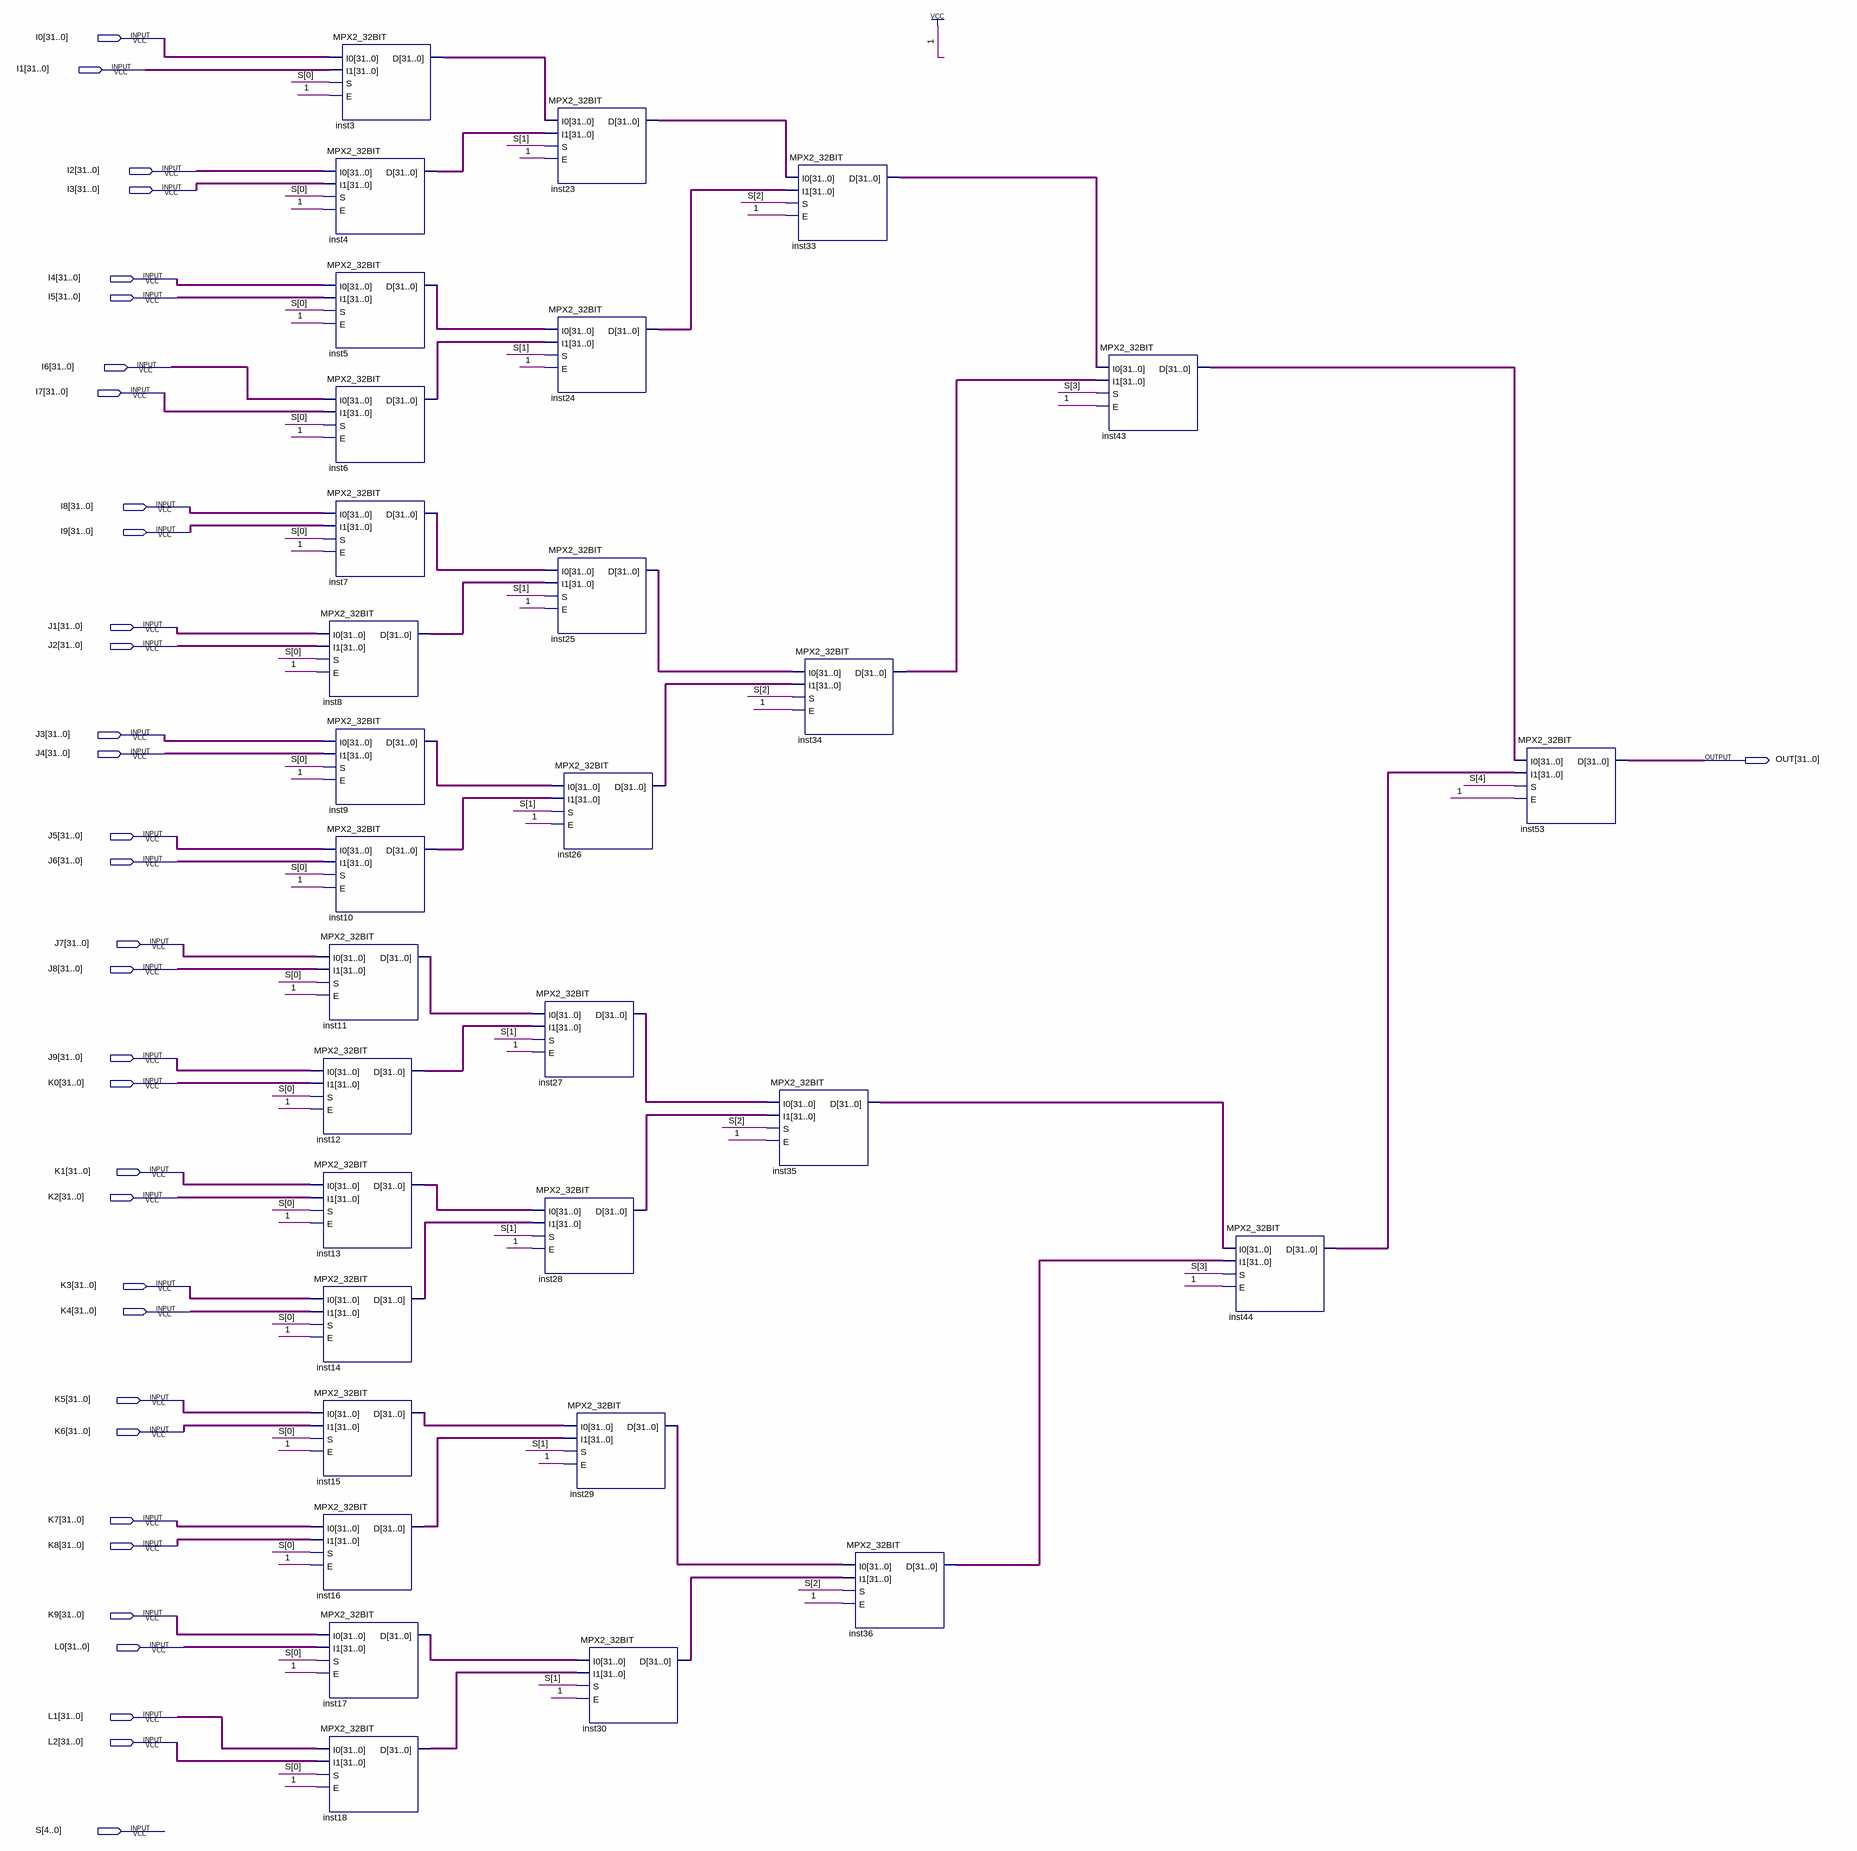
[diagram p0: schematic sheet]
// Quartus schematic MUX32_1.bdf as structural Verilog: 31 symbols, 34 pins
module MUX32_1 (
  input  [31:0] I0,
  input  [31:0] I1,
  input  [31:0] I2,
  input  [31:0] I3,
  input  [31:0] I4,
  input  [31:0] I5,
  input  [31:0] I6,
  input  [31:0] I7,
  input  [31:0] I8,
  input  [31:0] I9,
  input  [31:0] J1,
  input  [31:0] J2,
  input  [31:0] J3,
  input  [31:0] J4,
  input  [31:0] J5,
  input  [31:0] J6,
  input  [31:0] J7,
  input  [31:0] J8,
  input  [31:0] J9,
  input  [31:0] K0,
  input  [31:0] K1,
  input  [31:0] K2,
  input  [31:0] K3,
  input  [31:0] K4,
  input  [31:0] K5,
  input  [31:0] K6,
  input  [31:0] K7,
  input  [31:0] K8,
  input  [31:0] K9,
  input  [31:0] L0,
  input  [31:0] L1,
  input  [31:0] L2,
  input  [4:0] S,
  output [31:0] OUT
);

  wire [31:0] inst3_d, inst4_d, inst5_d, inst6_d, inst7_d, inst8_d, inst9_d, inst10_d, inst11_d, inst12_d,
       inst13_d, inst14_d, inst15_d, inst16_d, inst17_d, inst18_d, inst23_d, inst24_d, inst25_d, inst26_d,
       inst27_d, inst28_d, inst29_d, inst30_d, inst33_d, inst34_d, inst35_d, inst36_d, inst43_d, inst44_d;

  MPX2_32BIT inst4 (.I0(I2), .I1(I3), .S(S[0]), .E(1'b1), .D(inst4_d));
  MPX2_32BIT inst5 (.I0(I4), .I1(I5), .S(S[0]), .E(1'b1), .D(inst5_d));
  MPX2_32BIT inst6 (.I0(I6), .I1(I7), .S(S[0]), .E(1'b1), .D(inst6_d));
  MPX2_32BIT inst7 (.I0(I8), .I1(I9), .S(S[0]), .E(1'b1), .D(inst7_d));
  MPX2_32BIT inst8 (.I0(J1), .I1(J2), .S(S[0]), .E(1'b1), .D(inst8_d));
  MPX2_32BIT inst9 (.I0(J3), .I1(J4), .S(S[0]), .E(1'b1), .D(inst9_d));
  MPX2_32BIT inst10 (.I0(J5), .I1(J6), .S(S[0]), .E(1'b1), .D(inst10_d));
  MPX2_32BIT inst11 (.I0(J7), .I1(J8), .S(S[0]), .E(1'b1), .D(inst11_d));
  MPX2_32BIT inst12 (.I0(J9), .I1(K0), .S(S[0]), .E(1'b1), .D(inst12_d));
  MPX2_32BIT inst13 (.I0(K1), .I1(K2), .S(S[0]), .E(1'b1), .D(inst13_d));
  MPX2_32BIT inst14 (.I0(K3), .I1(K4), .S(S[0]), .E(1'b1), .D(inst14_d));
  MPX2_32BIT inst15 (.I0(K5), .I1(K6), .S(S[0]), .E(1'b1), .D(inst15_d));
  MPX2_32BIT inst16 (.I0(K7), .I1(K8), .S(S[0]), .E(1'b1), .D(inst16_d));
  MPX2_32BIT inst17 (.I0(K9), .I1(L0), .S(S[0]), .E(1'b1), .D(inst17_d));
  MPX2_32BIT inst18 (.I0(L1), .I1(L2), .S(S[0]), .E(1'b1), .D(inst18_d));
  MPX2_32BIT inst3 (.I0(I0), .I1(I1), .S(S[0]), .E(1'b1), .D(inst3_d));
  MPX2_32BIT inst23 (.I0(inst3_d), .I1(inst4_d), .S(S[1]), .E(1'b1), .D(inst23_d));
  MPX2_32BIT inst24 (.I0(inst5_d), .I1(inst6_d), .S(S[1]), .E(1'b1), .D(inst24_d));
  MPX2_32BIT inst25 (.I0(inst7_d), .I1(inst8_d), .S(S[1]), .E(1'b1), .D(inst25_d));
  MPX2_32BIT inst26 (.I0(inst9_d), .I1(inst10_d), .S(S[1]), .E(1'b1), .D(inst26_d));
  MPX2_32BIT inst27 (.I0(inst11_d), .I1(inst12_d), .S(S[1]), .E(1'b1), .D(inst27_d));
  MPX2_32BIT inst28 (.I0(inst13_d), .I1(inst14_d), .S(S[1]), .E(1'b1), .D(inst28_d));
  MPX2_32BIT inst29 (.I0(inst15_d), .I1(inst16_d), .S(S[1]), .E(1'b1), .D(inst29_d));
  MPX2_32BIT inst30 (.I0(inst17_d), .I1(inst18_d), .S(S[1]), .E(1'b1), .D(inst30_d));
  MPX2_32BIT inst35 (.I0(inst27_d), .I1(inst28_d), .S(S[2]), .E(1'b1), .D(inst35_d));
  MPX2_32BIT inst33 (.I0(inst23_d), .I1(inst24_d), .S(S[2]), .E(1'b1), .D(inst33_d));
  MPX2_32BIT inst34 (.I0(inst25_d), .I1(inst26_d), .S(S[2]), .E(1'b1), .D(inst34_d));
  MPX2_32BIT inst36 (.I0(inst29_d), .I1(inst30_d), .S(S[2]), .E(1'b1), .D(inst36_d));
  MPX2_32BIT inst43 (.I0(inst33_d), .I1(inst34_d), .S(S[3]), .E(1'b1), .D(inst43_d));
  MPX2_32BIT inst44 (.I0(inst35_d), .I1(inst36_d), .S(S[3]), .E(1'b1), .D(inst44_d));
  MPX2_32BIT inst53 (.I0(inst43_d), .I1(inst44_d), .S(S[4]), .E(1'b1), .D(OUT));
endmodule
